# Altium schematic sheet Encoder_ICMU150.SchDoc
size A4
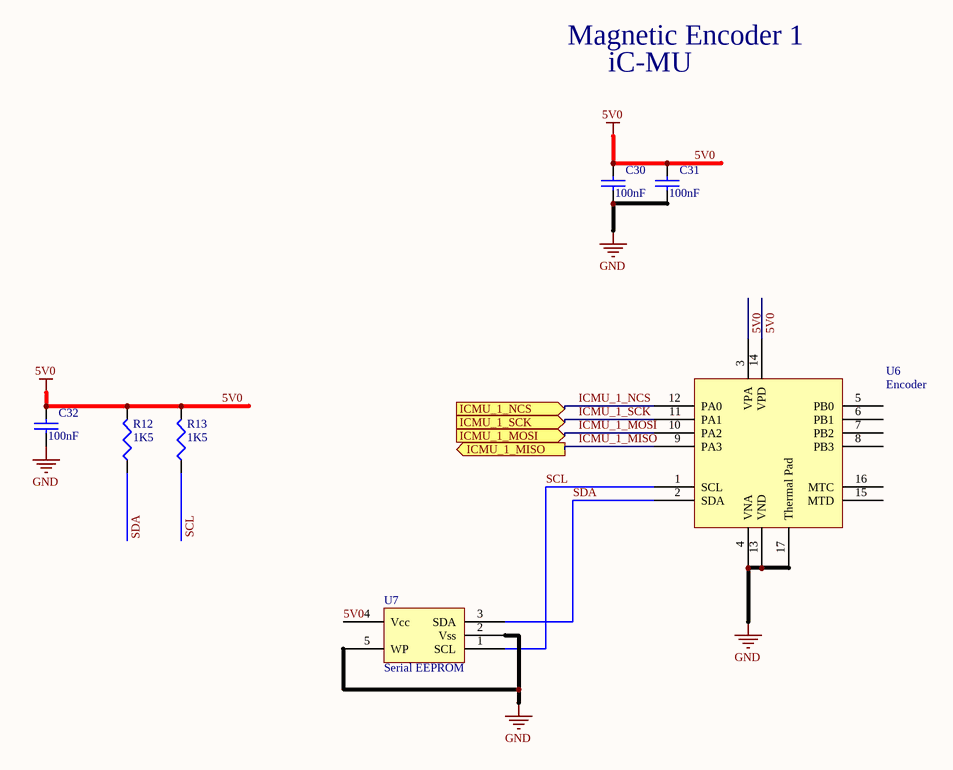
[diagram p0: Encoder_ICMU150.SchDoc]

## Parts
C30  value 100nF  [CAP0402]  (hidden comment: Capacitor)
C31  value 100nF  [CAP0402]  (hidden comment: Capacitor)
C32  value 100nF  [CAP0402]  (hidden comment: Capacitor)
R12  value 1K5  [RES0402]  (hidden comment: Res)
R13  value 1K5  [RES0402]  (hidden comment: Res)
U6  Encoder  [iC-MU RevC2]
U7  Serial EEPROM  [SOT23-5]

## Ports
ICMU_1_MISO (out), ICMU_1_MOSI (in), ICMU_1_NCS (in), ICMU_1_SCK (in)

## Nets
5V0: C30.1 C31.1 C32.1 R12.2 R13.2 U6.3(VPA) U6.14(VPD) U7.4(Vcc)
GND: C30.2 C31.2 C32.2 U6.4(VNA) U6.13(VND) U6.17(Thermal_Pad) U7.2(Vss) U7.5(WP)
ICMU_1_MISO: U6.9(PA3) ; port ICMU_1_MISO
ICMU_1_MOSI: U6.10(PA2) ; port ICMU_1_MOSI
ICMU_1_NCS: U6.12(PA0) ; port ICMU_1_NCS
ICMU_1_SCK: U6.11(PA1) ; port ICMU_1_SCK
SCL: R13.1 U6.1(SCL) U7.1(SCL)
SDA: R12.1 U6.2(SDA) U7.3(SDA)

Not connected (* = marked no-connect by the designer): U6 5(PB0) 6(PB1) 7(PB2) 8(PB3) 15(MTD) 16(MTC)

## Notes on the sheet
- Magnetic Encoder 1
- iC-MU

## Library data of the parts
C30-C32 = Capacitor: Manufacturer: TDK Corporation; Manufacturer Part Number: CGA2B3X7R1V104K050BB; Voltage: 35V; Supplier: Digi-Key; Supplier Part Number: 445-6901-1-ND; Tolerance: *; Footprint: 0402; Component Type: Capacitor Ceramic
R12 R13 = Resistor: Manufacturer: Yageo; Manufacturer Part Number: RC0402FR-071K5L; Component Type: Resistor; Supplier: Digi-Key; Supplier Part Number: 311-1.50KLRCT-ND; Power Rating: *; Footprint: 0402; Tolerance: *
U6 = IC-MU DFN16-5x5: Off Axis Encoder with Hall Sensors; Manufacturer: iC-Haus; Manufacturer Part Number: IC-MU150DFN16-5X5; Component Type: Magnetic Off-Axis Absolute Position Encoder - pole width 1.50 mm; Supplier: Symmetry Electronics; Supplier Part Number: IC-MU150DFN16-5X5
U7 = 24AA02T-I/OT: 2K I2C Serial EEPROM; Manufacturer: Microchip Technology; Footprint: SOT-23-5; Price: 0.28; Supplier: Digi-Key; Supplier Part Number: 24AA02T-I/OTCT-ND; Component Type: IC EEPROM 2KBIT 400KHZ SOT23-5; Manufacturer Part Number: 24AA02T-I/OT